# EAGLE schematic untitled (EAGLE 7.6.0)
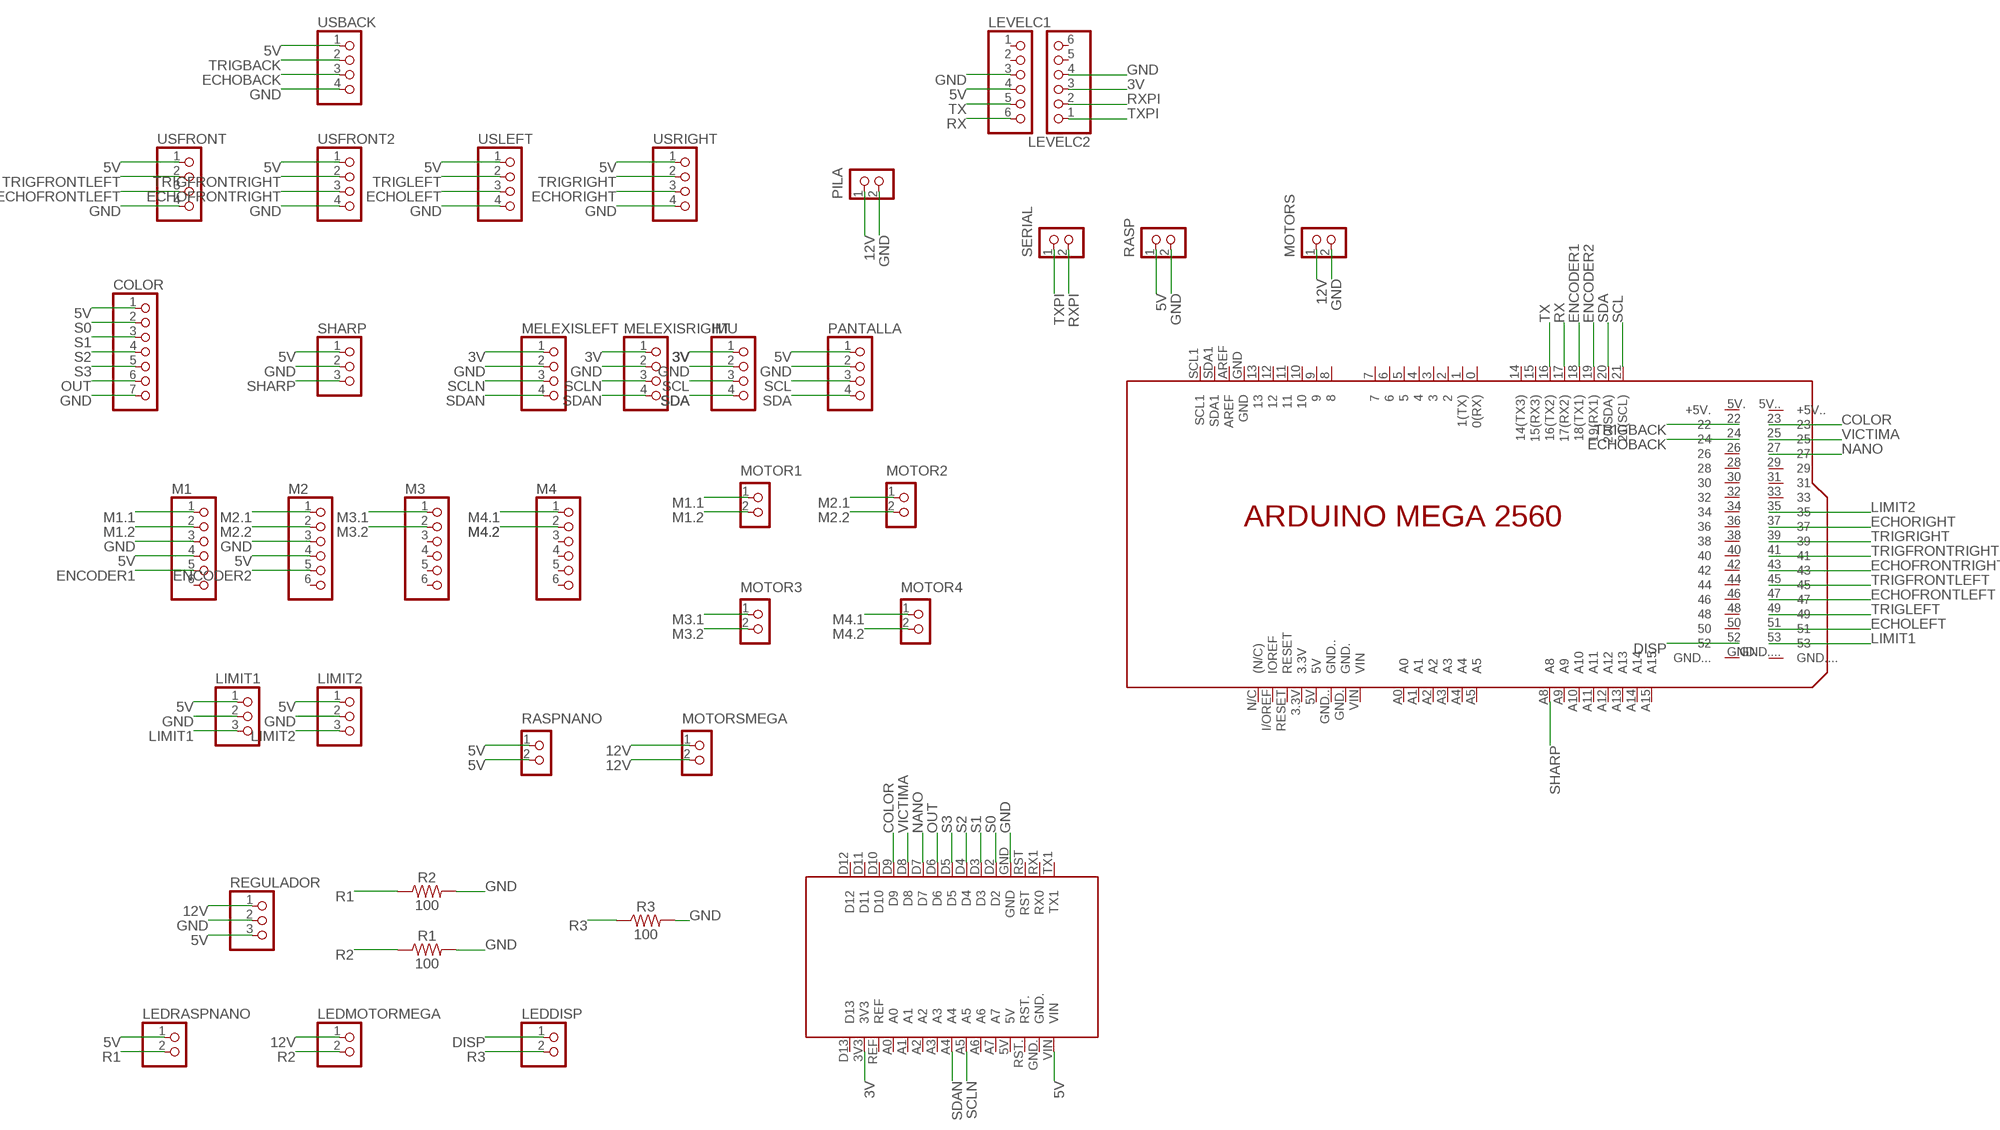
[diagram p0: schematic, sheet 1]

## Parts
COLOR  PINHD-1X7  [1X07]
IMU  PINHD-1X4  [1X04]
LEDDISP  PINHD-1X2  [1X02]
LEDMOTORMEGA  PINHD-1X2  [1X02]
LEDRASPNANO  PINHD-1X2  [1X02]
LEVELC1  PINHD-1X6  [1X06]
LEVELC2  PINHD-1X6  [1X06]
LIMIT1  PINHD-1X3  [1X03]
LIMIT2  PINHD-1X3  [1X03]
M1  PINHD-1X6  [1X06]
M2  PINHD-1X6  [1X06]
M3  PINHD-1X6  [1X06]
M4  PINHD-1X6  [1X06]
MEGA1  MEGA  [MEGA]
MELEXISLEFT  PINHD-1X4  [1X04]
MELEXISRIGHT  PINHD-1X4  [1X04]
MOTOR1  CON_TERMINAL_BLOCK_02-5MM  [TERMINAL_BLOCK_2P_5]
MOTOR2  CON_TERMINAL_BLOCK_02-5MM  [TERMINAL_BLOCK_2P_5]
MOTOR3  CON_TERMINAL_BLOCK_02-5MM  [TERMINAL_BLOCK_2P_5]
MOTOR4  CON_TERMINAL_BLOCK_02-5MM  [TERMINAL_BLOCK_2P_5]
MOTORS  CON_TERMINAL_BLOCK_02-5MM  [TERMINAL_BLOCK_2P_5]
MOTORSMEGA  CON_TERMINAL_BLOCK_02-5MM  [TERMINAL_BLOCK_2P_5]
PANTALLA  PINHD-1X4  [1X04]
PILA  CON_TERMINAL_BLOCK_02-5MM  [TERMINAL_BLOCK_2P_5]
R1  100  100OHM-HORIZ_KIT-1/4W-1%  [AXIAL-0.3EZ]
R2  100  100OHM-HORIZ_KIT-1/4W-1%  [AXIAL-0.3EZ]
R3  100  100OHM-HORIZ_KIT-1/4W-1%  [AXIAL-0.3EZ]
RASP  CON_TERMINAL_BLOCK_02-5MM  [TERMINAL_BLOCK_2P_5]
RASPNANO  CON_TERMINAL_BLOCK_02-5MM  [TERMINAL_BLOCK_2P_5]
REGULADOR  PINHD-1X3  [1X03]
SERIAL  CON_TERMINAL_BLOCK_02-5MM  [TERMINAL_BLOCK_2P_5]
SHARP  PINHD-1X3  [1X03]
U$1  NANO  [NANO]
USBACK  PINHD-1X4  [1X04]
USFRONT  PINHD-1X4  [1X04]
USFRONT2  PINHD-1X4  [1X04]
USLEFT  PINHD-1X4  [1X04]
USRIGHT  PINHD-1X4  [1X04]

## Nets
3V: IMU.1 LEVELC2.3 MELEXISLEFT.1 MELEXISRIGHT.1 U$1.3V3
5V: COLOR.1 LEDRASPNANO.1 LEVELC1.4 LIMIT1.1 LIMIT2.1 M1.4 M2.4 PANTALLA.1 RASP.1 RASPNANO.1 RASPNANO.2 REGULADOR.3 SHARP.1 U$1.VIN USBACK.1 USFRONT2.1 USFRONT.1 USLEFT.1 USRIGHT.1
12V: LEDMOTORMEGA.1 MOTORS.1 MOTORSMEGA.1 MOTORSMEGA.2 PILA.1 REGULADOR.1
COLOR: MEGA1.23 U$1.D9
DISP: LEDDISP.1 MEGA1.52
ECHOBACK: MEGA1.24 USBACK.3
ECHOFRONTLEFT: MEGA1.47 USFRONT.3
ECHOFRONTRIGHT: MEGA1.43 USFRONT2.3
ECHOLEFT: MEGA1.51 USLEFT.3
ECHORIGHT: MEGA1.37 USRIGHT.3
ENCODER1: M1.5 MEGA1.18(18(TX1))
ENCODER2: M2.5 MEGA1.19(19(RX1))
GND: COLOR.7 IMU.2 LEVELC1.3 LEVELC2.4 LIMIT1.2 LIMIT2.2 M1.3 M2.3 MELEXISLEFT.2 MELEXISRIGHT.2 MOTORS.2 PANTALLA.2 PILA.2 R1.P$2 R2.P$2 R3.P$2 RASP.2 REGULADOR.2 SHARP.2 U$1.GND USBACK.4 USFRONT2.4 USFRONT.4 USLEFT.4 USRIGHT.4
LIMIT1: LIMIT1.3 MEGA1.53
LIMIT2: LIMIT2.3 MEGA1.35
M1.1: M1.1 MOTOR1.1
M1.2: M1.2 MOTOR1.2
M2.1: M2.1 MOTOR2.1
M2.2: M2.2 MOTOR2.2
M3.1: M3.1 MOTOR3.1
M3.2: M3.2 MOTOR3.2
M4.1: M4.1 MOTOR4.1
M4.2: M4.2 MOTOR4.2
NANO: MEGA1.27 U$1.D7
OUT: COLOR.6 U$1.D6
R1: LEDRASPNANO.2 R2.P$1
R2: LEDMOTORMEGA.2 R1.P$1
R3: LEDDISP.2 R3.P$1
RX: LEVELC1.6 MEGA1.17(17(RX2))
RXPI: LEVELC2.2 SERIAL.2
S0: COLOR.2 U$1.D2
S1: COLOR.3 U$1.D3
S2: COLOR.4 U$1.D4
S3: COLOR.5 U$1.D5
SCL: IMU.3 MEGA1.21(21(SCL)) PANTALLA.3
SCLN: MELEXISLEFT.3 MELEXISRIGHT.3 U$1.A5
SDA: IMU.4 MEGA1.20(20(SDA)) PANTALLA.4
SDAN: MELEXISLEFT.4 MELEXISRIGHT.4 U$1.A4
SHARP: MEGA1.A8 SHARP.3
TRIGBACK: MEGA1.22 USBACK.2
TRIGFRONTLEFT: MEGA1.45 USFRONT.2
TRIGFRONTRIGHT: MEGA1.41 USFRONT2.2
TRIGLEFT: MEGA1.49 USLEFT.2
TRIGRIGHT: MEGA1.39 USRIGHT.2
TX: LEVELC1.5 MEGA1.16(16(TX2))
TXPI: LEVELC2.1 SERIAL.1
VICTIMA: MEGA1.25 U$1.D8
Unconnected: LEVELC1.1 LEVELC1.2 LEVELC2.5 LEVELC2.6 M1.6 M2.6 M3.3 M3.4 M3.5 M3.6 M4.3 M4.4 M4.5 M4.6 MEGA1.0(0(RX)) MEGA1.1(1(TX)) MEGA1.2 MEGA1.3 MEGA1.3.3V MEGA1.4 MEGA1.5 MEGA1.5V MEGA1.5V.(+5V.) MEGA1.5V..(+5V..) MEGA1.6 MEGA1.7 MEGA1.8 MEGA1.9 MEGA1.10 MEGA1.11 MEGA1.12 MEGA1.13 MEGA1.14(14(TX3)) MEGA1.15(15(RX3)) MEGA1.26 MEGA1.28 MEGA1.29 MEGA1.30 MEGA1.31 MEGA1.32 MEGA1.33 MEGA1.34 MEGA1.36 MEGA1.38 MEGA1.40 MEGA1.42 MEGA1.44 MEGA1.46 MEGA1.48 MEGA1.50 MEGA1.A0 MEGA1.A1 MEGA1.A2 MEGA1.A3 MEGA1.A4 MEGA1.A5 MEGA1.A9 MEGA1.A10 MEGA1.A11 MEGA1.A12 MEGA1.A13 MEGA1.A14 MEGA1.A15 MEGA1.AREF MEGA1.GND MEGA1.GND. MEGA1.GND.. MEGA1.GND... MEGA1.GND.... MEGA1.I/OREF(IOREF) MEGA1.N/C((N/C)) MEGA1.RESET MEGA1.SCL1 MEGA1.SDA1 MEGA1.VIN U$1.5V U$1.A0 U$1.A1 U$1.A2 U$1.A3 U$1.A6 U$1.A7 U$1.D10 U$1.D11 U$1.D12 U$1.D13 U$1.GND. U$1.REF U$1.RST U$1.RST. U$1.RX1(RX0) U$1.TX1

## Library data of the parts
COLOR = pinhead:PINHD-1X7: PIN HEADER
IMU MELEXISLEFT MELEXISRIGHT PANTALLA USBACK USFRONT USFRONT2 USLEFT USRIGHT = pinhead:PINHD-1X4: PIN HEADER
LEDDISP LEDMOTORMEGA LEDRASPNANO = pinhead:PINHD-1X2: PIN HEADER
LEVELC1 LEVELC2 M1-M4 = pinhead:PINHD-1X6: PIN HEADER
LIMIT1 LIMIT2 REGULADOR SHARP = pinhead:PINHD-1X3: PIN HEADER
MEGA1 = ROBORREGOS:MEGA
MOTOR1-MOTOR4 MOTORS MOTORSMEGA PILA RASP RASPNANO SERIAL = dp_devices:CON_TERMINAL_BLOCK_02: 2 poles wire to board terminal block
R1-R3 = SparkFun-Resistors:100OHM: 100Ω resistor A resistor is a passive two-terminal electrical component that implements electrical resistance as a circuit element. Resistors act to reduce current flow, and, at the same time, act to lower voltage levels within circuits. - Wikipedia; PROD_ID: RES-12181
U$1 = ROBORREGOS:NANO